# EAGLE design KissCart64-8K-DIP (EAGLE 6.6.0)
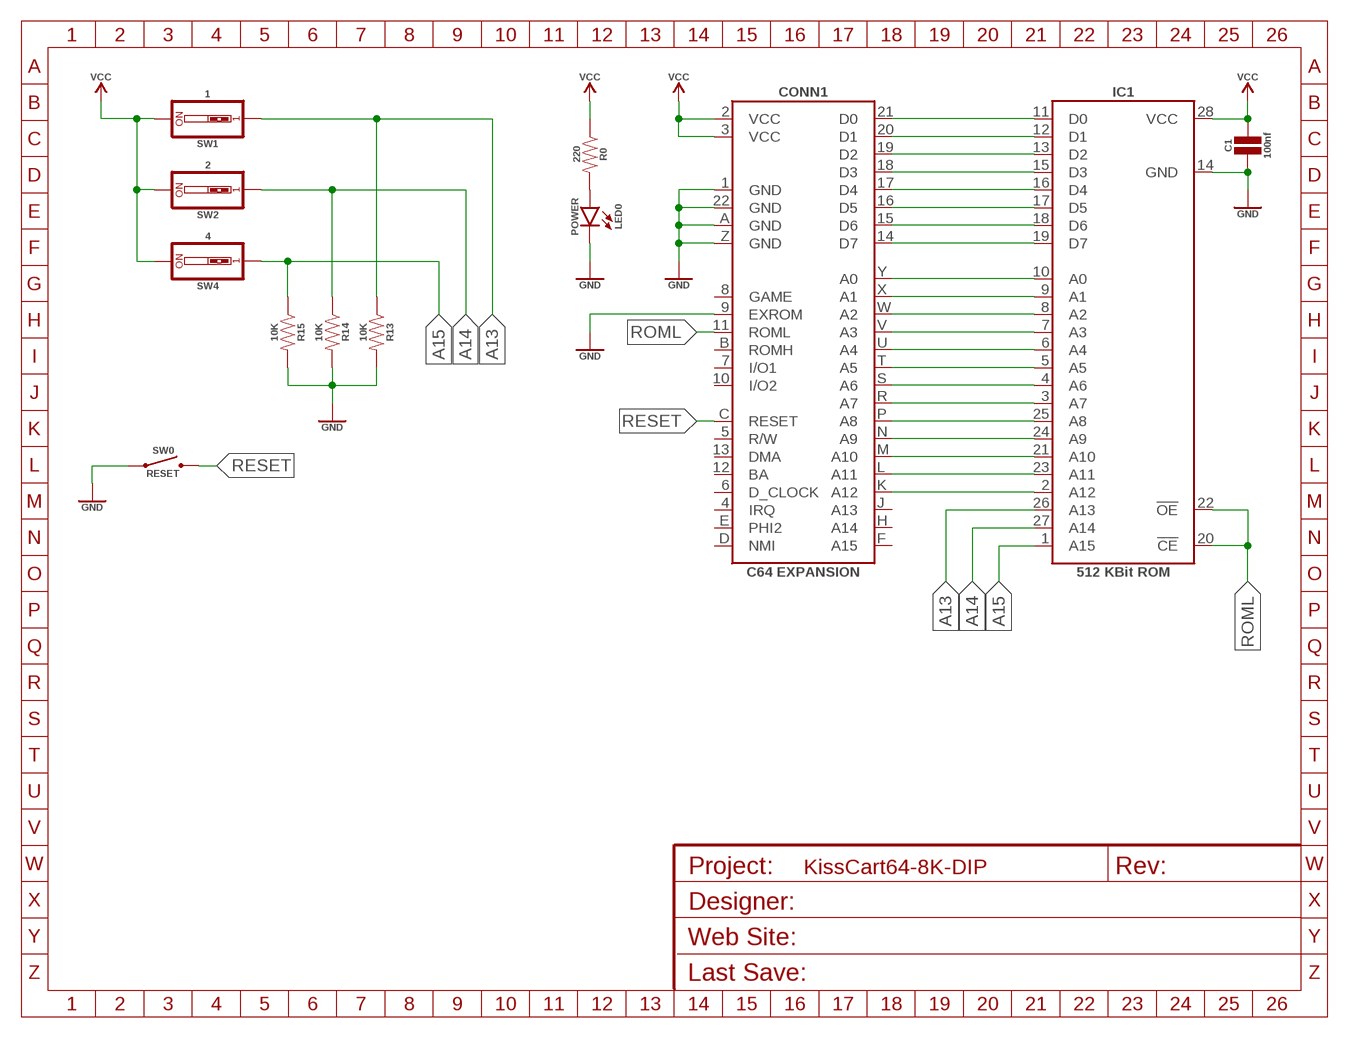
[diagram p0: schematic, sheet 1]
FRAME1 (FRAME_A5L): DESIGNER: Simon/CGTr; REVISION: 1.0; WEBSITE: http://www.commodore.gen.tr

## Parts
C1  100nf  CAPACITOR_CERAMIC_0.2  [CAPACITOR_CERAMIC_0.2]
CONN1  C64 EXPANSION  C64_CARTDRIGE  [C64_CARTRIDGE]
IC1  512 KBit ROM  27C512_DIP  [DIP28W]
LED0  POWER  LED_NORMAL_1206  [LED_1206]
R0  220  RESISTOR_SMT_1206  [RESISTOR_SMT_1206]
R13  10K  RESISTOR_SMT_1206  [RESISTOR_SMT_1206]
R14  10K  RESISTOR_SMT_1206  [RESISTOR_SMT_1206]
R15  10K  RESISTOR_SMT_1206  [RESISTOR_SMT_1206]
SW0  RESET  SWITCH_THT_SIDE  [SWITCH_THT_SIDE]
SW1  1  SWITCH_DIP_01  [SWITCH_DIP_01]
SW2  2  SWITCH_DIP_01  [SWITCH_DIP_01]
SW4  4  SWITCH_DIP_01  [SWITCH_DIP_01]

## Nets
A0: CONN1.Y(A0) IC1.10(A0)
A1: CONN1.X(A1) IC1.9(A1)
A2: CONN1.W(A2) IC1.8(A2)
A3: CONN1.V(A3) IC1.7(A3)
A4: CONN1.U(A4) IC1.6(A4)
A5: CONN1.T(A5) IC1.5(A5)
A6: CONN1.S(A6) IC1.4(A6)
A7: CONN1.R(A7) IC1.3(A7)
A8: CONN1.P(A8) IC1.25(A8)
A9: CONN1.N(A9) IC1.24(A9)
A10: CONN1.M(A10) IC1.21(A10)
A11: CONN1.L(A11) IC1.23(A11)
A12: CONN1.K(A12) IC1.2(A12)
A13: IC1.26(A13) R13.1 SW1.1
A14: IC1.27(A14) R14.1 SW2.1
A15: IC1.1(A15) R15.1 SW4.1
D0: CONN1.21(D0) IC1.11(D0)
D1: CONN1.20(D1) IC1.12(D1)
D2: CONN1.19(D2) IC1.13(D2)
D3: CONN1.18(D3) IC1.15(D3)
D4: CONN1.17(D4) IC1.16(D4)
D5: CONN1.16(D5) IC1.17(D5)
D6: CONN1.15(D6) IC1.18(D6)
D7: CONN1.14(D7) IC1.19(D7)
GND: C1.1 CONN1.1(GND) CONN1.9(EXROM) CONN1.22(GND) CONN1.A(GND) CONN1.Z(GND) IC1.14(GND) LED0.C R13.2 R14.2 R15.2 SW0.1
LED0_1: LED0.A R0.2
RESET: CONN1.C(RESET) SW0.2
ROML: CONN1.11(ROML) IC1.20(!CE) IC1.22(!OE)
VCC: C1.2 CONN1.2(VCC) CONN1.3(VCC) IC1.28(VCC) R0.1 SW1.2 SW2.2 SW4.2
Unconnected: CONN1.4(IRQ) CONN1.5(R/W) CONN1.6(D_CLOCK) CONN1.7(I/O1) CONN1.8(GAME) CONN1.10(I/O2) CONN1.12(BA) CONN1.13(DMA) CONN1.B(ROMH) CONN1.D(NMI) CONN1.E(PHI2) CONN1.F(A15) CONN1.H(A14) CONN1.J(A13)

## Library data of the parts
C1 = sj_standart:CAPACITOR_CERAMIC: Ceramic Capacitor
CONN1 = sj_commodore:C64_CARTDRIGE: C64 Cartridge Pads
IC1 = sj_ic:27C512: CMOS EPROM 512 K (64 K x 8)
LED0 = sj_standart:LED_NORMAL: Standard LED
R0 R13-R15 = sj_standart:RESISTOR: Resistor
SW0 = sj_standart:SWITCH: Switch
SW1 SW2 SW4 = sj_standart:SWITCH_DIP_01: 1-bit DIP Switch

## Board
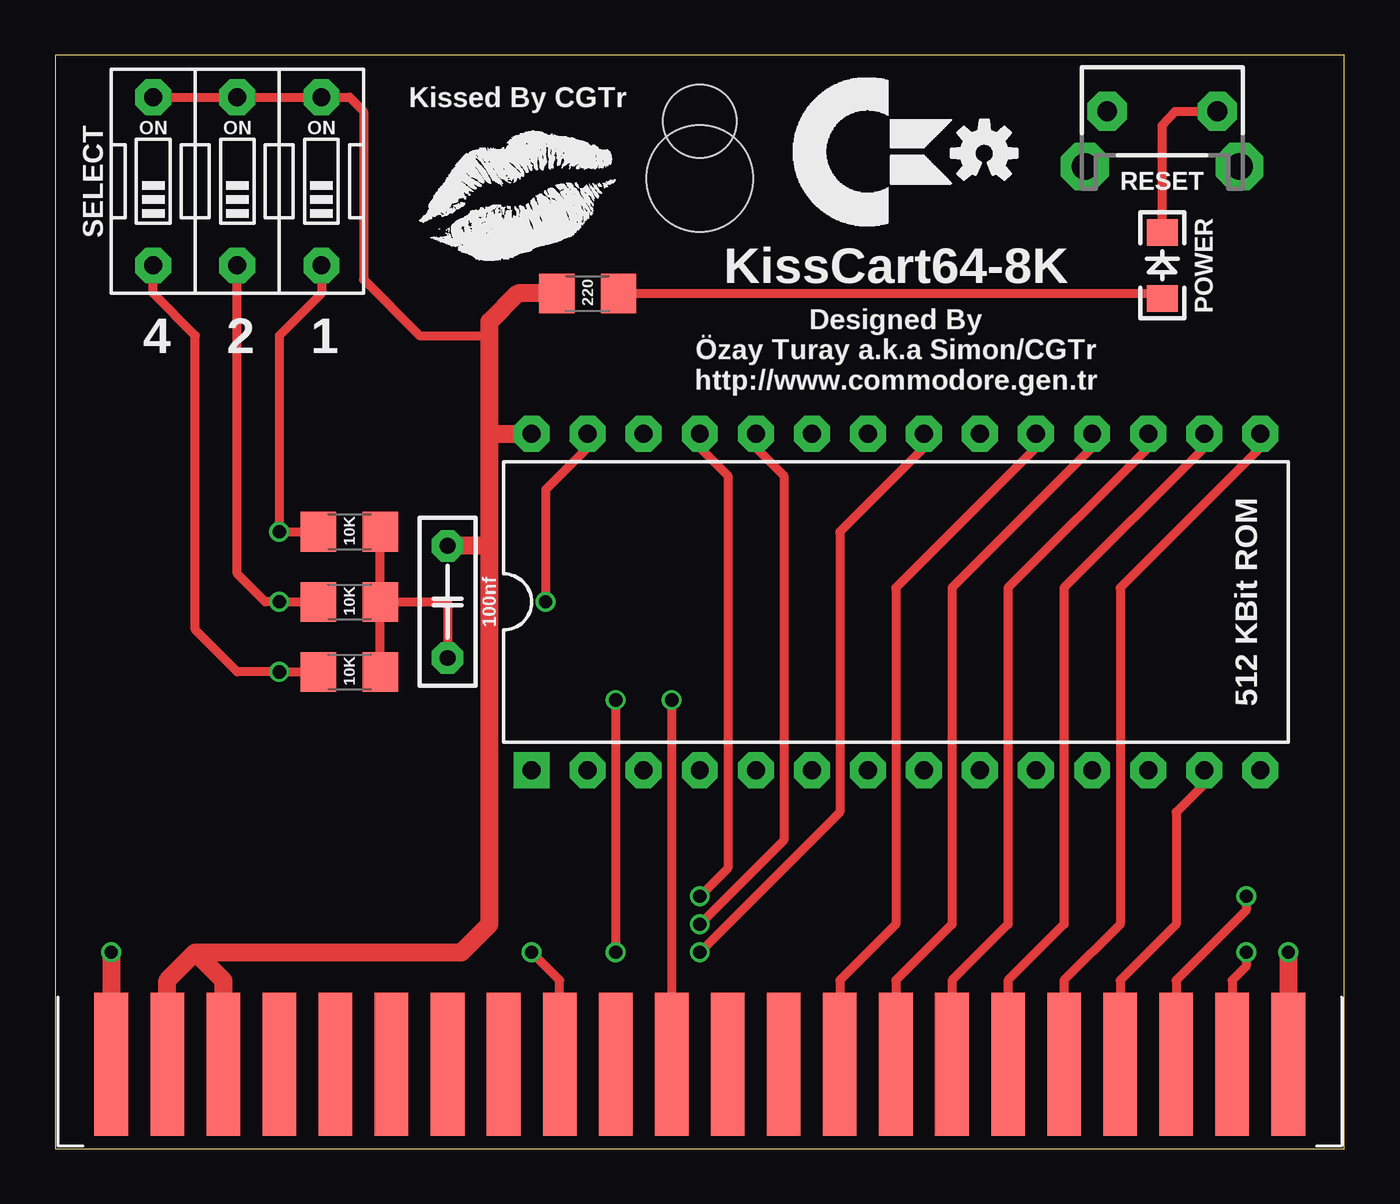
[diagram p1: board, top side]
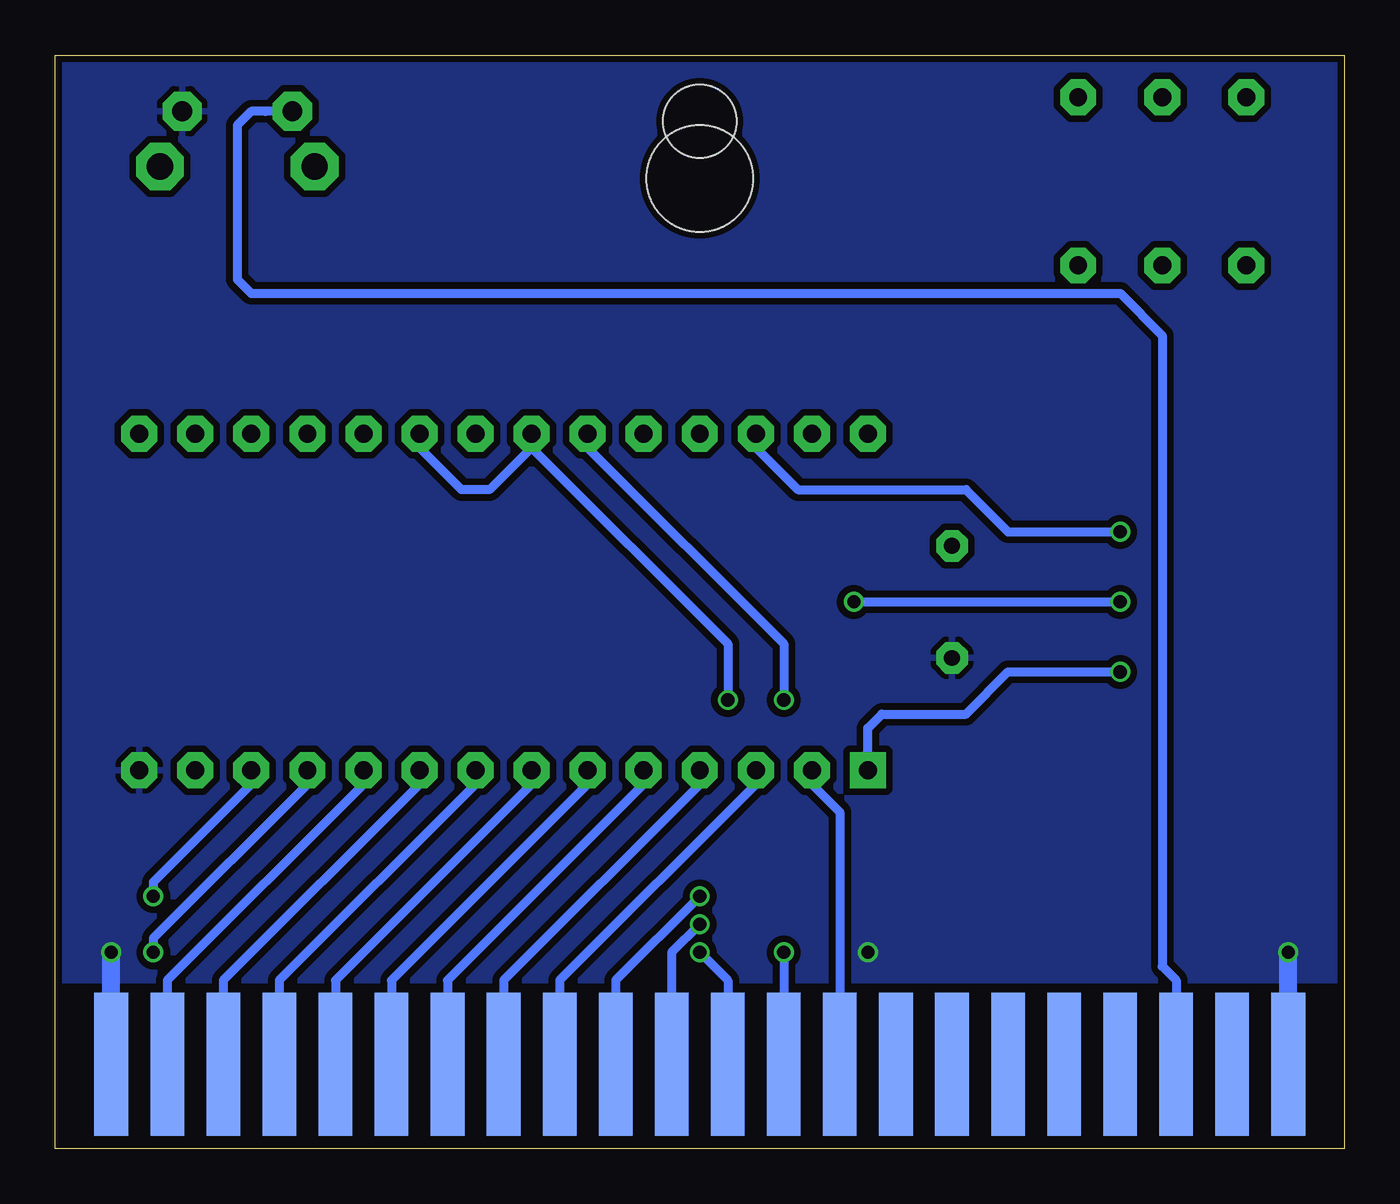
[diagram p2: board, bottom side, seen from below]

Size 58.42 x 49.53 mm. Coordinates in mm from the lower left corner, seen from the top.
Outline: 0,0 58.42,0 58.42,49.53 0,49.53 0,0
Copper layers (1*16): Top 0.035mm / dielectric 1.5mm / Bottom 0.035mm
Design rules "DirtyPCBs": minimum track width 5mil, minimum drill 12mil, track to track 5mil, track to pad 5mil, pad to pad 5mil, via to via 5mil, smd to smd 0mil, copper to edge 10mil, drill to drill 10mil, minimum pad ring 10mil, minimum via ring 6mil, stop-mask expansion 2mil, vias tented up to drill 25mil, thermal gap 10mil
Holes 4.8 mm at 29.21,43.94
Holes 3.3 mm at 29.21,46.54

### Footprints (pad centres in the part's own frame; a part is rotated, then mirrored left to right if it is on the bottom)
CAPACITOR_CERAMIC_0.2 = drill 0.711 pad 1.422 octagon: 1 -2.54,0; 2 2.54,0
C64_CARTRIDGE = smd 1.524 x 6.477: 1 -26.67,-0.635; 2 -24.13,-0.635; 3 -21.59,-0.635; 4 -19.05,-0.635; 5 -16.51,-0.635; 6 -13.97,-0.635; 7 -11.43,-0.635; 8 -8.89,-0.635; 9 -6.35,-0.635; 10 -3.81,-0.635; 11 -1.27,-0.635; 12 1.27,-0.635; 13 3.81,-0.635; 14 6.35,-0.635; 15 8.89,-0.635; 16 11.43,-0.635; 17 13.97,-0.635; 18 16.51,-0.635; 19 19.05,-0.635; 20 21.59,-0.635; 21 24.13,-0.635; 22 26.67,-0.635 | smd 1.524 x 6.477 bottom: A -26.67,-0.635; B -24.13,-0.635; C -21.59,-0.635; D -19.05,-0.635; E -16.51,-0.635; F -13.97,-0.635; H -11.43,-0.635; J -8.89,-0.635; K -6.35,-0.635; L -3.81,-0.635; M -1.27,-0.635; N 1.27,-0.635; P 3.81,-0.635; R 6.35,-0.635; S 8.89,-0.635; T 11.43,-0.635; U 13.97,-0.635; V 16.51,-0.635; W 19.05,-0.635; X 21.59,-0.635; Y 24.13,-0.635; Z 26.67,-0.635
DIP28W = drill 0.813 pad 1.626 square: 1 -16.51,-7.62 | drill 0.813 pad 1.626 octagon: 2 -13.97,-7.62; 3 -11.43,-7.62; 4 -8.89,-7.62; 5 -6.35,-7.62; 6 -3.81,-7.62; 7 -1.27,-7.62; 8 1.27,-7.62; 9 3.81,-7.62; 10 6.35,-7.62; 11 8.89,-7.62; 12 11.43,-7.62; 13 13.97,-7.62; 14 16.51,-7.62; 15 16.51,7.62; 16 13.97,7.62; 17 11.43,7.62; 18 8.89,7.62; 19 6.35,7.62; 20 3.81,7.62; 21 1.27,7.62; 22 -1.27,7.62; 23 -3.81,7.62; 24 -6.35,7.62; 25 -8.89,7.62; 26 -11.43,7.62; 27 -13.97,7.62; 28 -16.51,7.62
LED_1206 = smd 1.2 x 1.4: A -1.5,0; C 1.5,0
RESISTOR_SMT_1206 = smd 1.6 x 1.8: 1 -1.4,0; 2 1.4,0
SWITCH_THT_SIDE = drill 0.889 pad 1.778 octagon: 1 -2.5,0; 2 2.5,0 | drill 1.194 pad 2.159 octagon: ANCHOR1 -3.5,2.5; ANCHOR2 3.5,2.5
SWITCH_DIP_01 = drill 0.813 pad 1.626 octagon: 1 0,-3.81; 2 0,3.81

### Placement (x,y rotation side)
C1  17.78,24.77 90 top
CONN1  29.21,4.45 0 top
IC1  38.1,24.77 0 top
LED0  50.16,40.01 90 top
LOGO1  OSHW_LOGO_SMALL  [OSHW_LOGO_SMALL]  42.1,45.09 0 top
R0  24.13,38.73 0 top
R13  13.34,27.94 0 top
R14  13.34,24.77 0 top
R15  13.34,21.59 0 top
SW0  50.16,46.99 180 top
SW1  12.06,43.81 0 top
SW2  8.26,43.81 0 top
SW4  4.45,43.81 0 top

### Tracks (layer width: path | path; a pad name or v marks a point on that pad's centre or on a via)
A0
  Bottom 0.406: IC1.10 44.45,16.51 53.34,7.62 CONN1.Y
A1
  Bottom 0.406: IC1.9 41.91,16.51 50.8,7.62 50.8,6.99 CONN1.X
A2
  Bottom 0.406: IC1.8 39.37,16.51 48.26,7.62 48.26,6.99 CONN1.W
A3
  Bottom 0.406: IC1.7 36.83,16.51 45.09,8.26 45.72,7.62 45.72,6.99 CONN1.V
A4
  Bottom 0.406: IC1.6 34.29,16.51 43.18,7.62 43.18,6.99 CONN1.U
A5
  Bottom 0.406: IC1.5 31.75,16.51 40.64,7.62 40.64,6.99 CONN1.T
A6
  Bottom 0.406: IC1.4 29.21,16.51 38.1,7.62 38.1,6.99 CONN1.S
A7
  Bottom 0.406: IC1.3 26.67,16.51 35.56,7.62 CONN1.R
A8  (via drill 0.6)
  Top 0.406: IC1.25 29.21,31.75 30.48,30.48 30.48,12.7 v29.21,11.43
  Bottom 0.406: v29.21,11.43 33.02,7.62 CONN1.P
A9  (via drill 0.6)
  Top 0.406: IC1.24 31.75,31.75 33.02,30.48 33.02,13.97 v29.21,10.16
  Bottom 0.406: v29.21,10.16 30.48,8.89 CONN1.N
A10  (via drill 0.6)
  Top 0.406: IC1.21 39.37,31.75 35.56,27.94 35.56,15.24 v29.21,8.89
  Bottom 0.406: v29.21,8.89 27.94,7.62 CONN1.M
A11  (via drill 0.6)
  Top 0.406: v25.4,20.32 v25.4,8.89
  Bottom 0.406: IC1.23 34.29,31.75 25.4,22.86 v25.4,20.32 | v25.4,8.89 CONN1.L
A12
  Bottom 0.406: IC1.2 24.13,16.51 22.86,15.24 CONN1.K
A13  (via drill 0.6)
  Top 0.406: R13.1 v10.16,27.94 10.16,36.83 12.06,38.73 SW1.1
  Bottom 0.406: IC1.26 26.67,31.75 24.77,29.84 17.14,29.84 15.24,27.94 v10.16,27.94
A14  (via drill 0.6)
  Top 0.406: IC1.27 24.13,31.75 22.23,29.84 v22.23,24.77 | R14.1 v10.16,24.77 9.53,24.77 8.26,26.04 SW2.1
  Bottom 0.406: v22.23,24.77 v10.16,24.77
A15  (via drill 0.6)
  Top 0.406: R15.1 v10.16,21.59 8.26,21.59 6.35,23.5 6.35,36.83 4.45,38.73 SW4.1
  Bottom 0.406: IC1.1 21.59,19.05 20.95,19.68 17.14,19.68 15.24,21.59 v10.16,21.59
D0  (via drill 0.6)
  Top 0.406: v53.98,8.89 53.98,8.26 53.34,7.62 CONN1.21
  Bottom 0.406: IC1.11 46.99,16.51 53.98,9.53 v53.98,8.89
D1  (via drill 0.6)
  Top 0.406: v53.98,11.43 53.98,10.79 50.8,7.62 CONN1.20
  Bottom 0.406: IC1.12 49.53,16.51 53.98,12.06 v53.98,11.43
D2
  Top 0.406: IC1.13 52.07,16.51 50.8,15.24 50.8,10.16 48.26,7.62 CONN1.19
D3
  Top 0.406: IC1.15 54.61,31.75 48.26,25.4 48.26,10.16 45.72,7.62 CONN1.18
D4
  Top 0.406: IC1.16 52.07,31.75 45.72,25.4 45.72,10.16 43.18,7.62 CONN1.17
D5
  Top 0.406: IC1.17 49.53,31.75 43.18,25.4 43.18,10.16 40.64,7.62 CONN1.16
D6
  Top 0.406: IC1.18 46.99,31.75 40.64,25.4 40.64,10.16 38.1,7.62 CONN1.15
D7
  Top 0.406: IC1.19 44.45,31.75 38.1,25.4 38.1,10.16 35.56,7.62 CONN1.14
GND  (via drill 0.6)
  Top 0.406: CONN1.9 22.86,7.62 v21.59,8.89 | LED0.C 50.16,46.35 50.76,46.99 SW0.1 | 15.24,22.23 15.24,21.59 R15.2 R14.2 | C1.1 17.78,24.77 R14.2 | R14.2 R13.2
  Top 0.813: v2.54,8.89 CONN1.A | v55.88,8.89 CONN1.Z
  Bottom 0.813: CONN1.A v2.54,8.89 | CONN1.Z v55.88,8.89
  pour Bottom (isolate 0.305): 0,7.62 58.42,7.62 58.42,49.53 0,49.53
LED0_1
  Top 0.406: R0.2 50.16,38.73 LED0.A
RESET
  Bottom 0.406: 48.9,46.99 SW0.2 49.53,46.99 50.16,46.35 50.16,39.37 49.53,38.73 10.16,38.73 8.26,36.83 8.26,8.26 7.62,7.62 CONN1.C
ROML  (via drill 0.6)
  Top 0.406: v27.94,20.32 CONN1.11
  Bottom 0.406: 36.83,31.75 38.73,29.84 40.01,29.84 41.91,31.75 IC1.20 | 36.83,31.75 27.94,22.86 v27.94,20.32 | IC1.22 36.83,31.75
VCC
  Top 0.406: C1.2 | SW4.2 SW2.2 SW1.2 13.34,47.62 13.97,46.99 13.97,39.37 16.51,36.83 19.68,36.83
  Top 0.813: CONN1.3 7.62,7.62 6.35,8.89 | CONN1.2 5.08,7.62 6.35,8.89 | 19.68,27.3 19.68,10.16 18.41,8.89 6.35,8.89 | 19.68,27.3 C1.2 | 19.68,27.3 19.68,32.38 | 19.68,32.38 IC1.28 | R0.1 20.95,38.73 19.68,37.47 19.68,36.83 19.68,32.38

### Text on the board
tPlace: Kissed By CGTr | SELECT | KissCart64-8K | Designed By / Özay Turay a.k.a Simon/CGTr / http://www.commodore.gen.tr